# EAGLE schematic wordclock-r6-4x6 (EAGLE 5.11)
DIGIKEY: 300-8761-ND
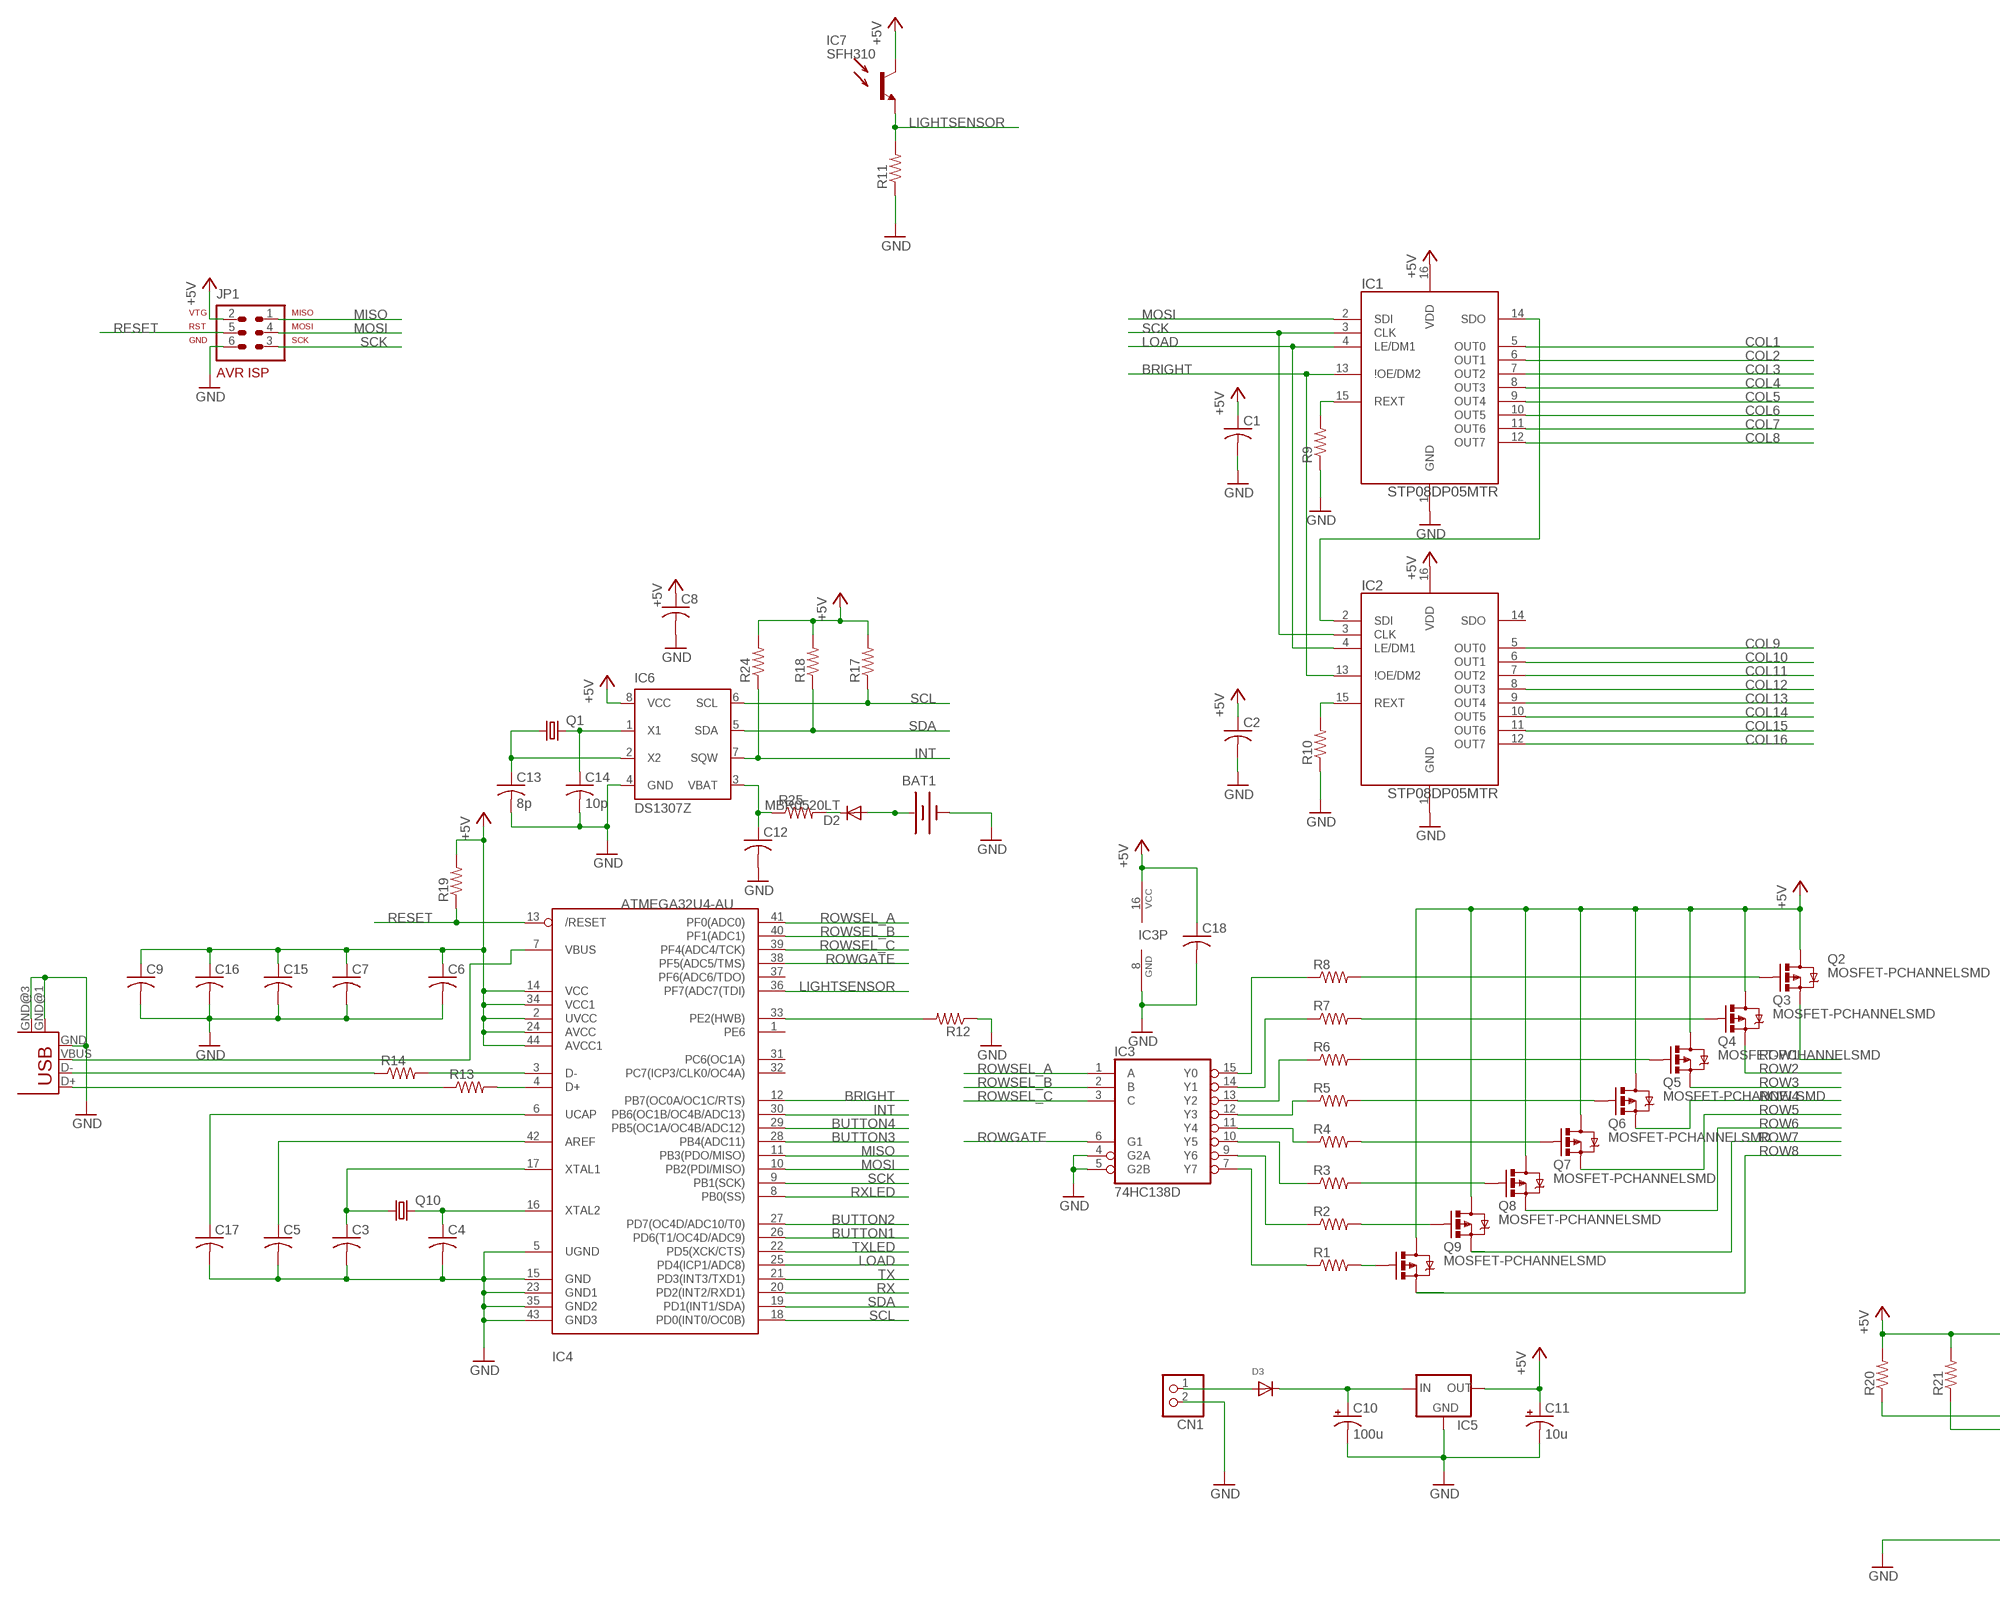
[diagram p0: schematic, sheet 1, part 1 of 2]
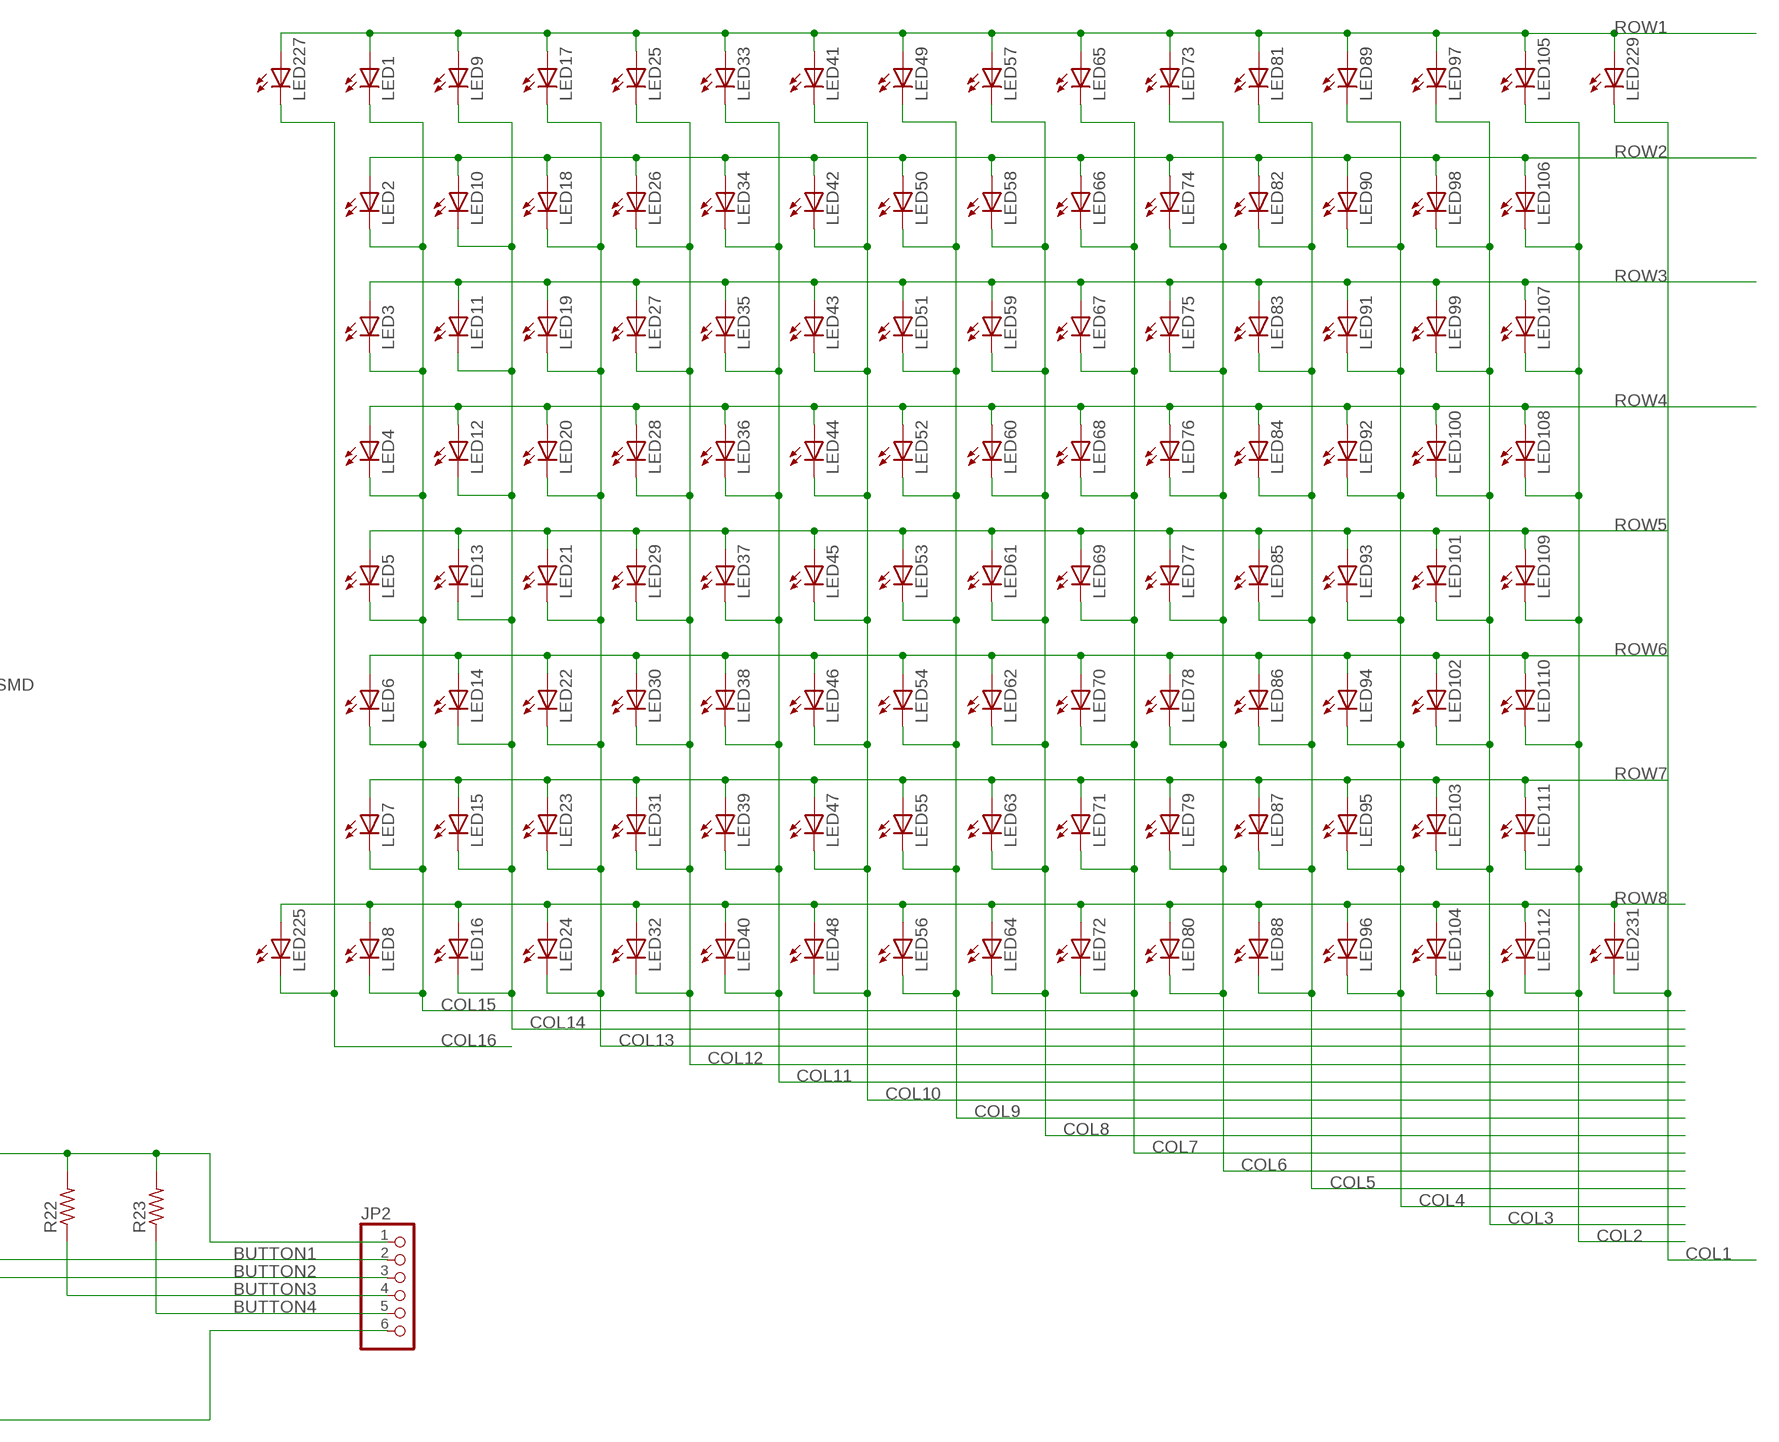
[diagram p1: schematic, sheet 1, part 2 of 2]

## Parts
BAT1  BATTERY12MM  [BATTCON_12MM]
C1  C-USC0603  [C0603]
C2  C-USC0603  [C0603]
C3  C-USC0603  [C0603]
C4  C-USC0603  [C0603]
C5  C-USC0603  [C0603]
C6  C-USC0603  [C0603]
C7  C-USC0603  [C0603]
C8  C-USC0603  [C0603]
C9  C-USC0603  [C0603]
C10  100u  CPOL-USD  [PANASONIC_D]
C11  10u  CPOL-USB  [PANASONIC_B]
C12  C-USC0603  [C0603]
C13  8p  C-USC0603  [C0603]
C14  10p  C-USC0603  [C0603]
C15  C-USC0603  [C0603]
C16  C-USC0603  [C0603]
C17  C-USC0603  [C0603]
C18  C-USC0603  [C0603]
CN1  JST_2PIN-SMT-RA  [JST-PH-2-SMT-RA]
D2  MBR0520LT  [SOD123]
D3  DIODESMA  [SMADIODE]
IC1  STP08DP05MTR  [SOIC-16]
IC2  STP08DP05MTR  [SOIC-16]
IC3  74HC138D  74LS138D  [SO16]
IC4  ATMEGA32U4-AU  [TQFP44]
IC5  LM1117  [SOT223]
IC6  DS1307Z  [SOIC8]
IC7  SFH310  [LED3MM]
JP1  AVR-ISP-6  [AVR-ISP-6]
JP2  PINHD-1X06_2.54-SMD-90°  [1X06SMD/90]
LED1  LEDKA-3528ASYC  [KA-3528ASYC]
LED2  LEDKA-3528ASYC  [KA-3528ASYC]
LED3  LEDKA-3528ASYC  [KA-3528ASYC]
LED4  LEDKA-3528ASYC  [KA-3528ASYC]
LED5  LEDKA-3528ASYC  [KA-3528ASYC]
LED6  LEDKA-3528ASYC  [KA-3528ASYC]
LED7  LEDKA-3528ASYC  [KA-3528ASYC]
LED8  LEDKA-3528ASYC  [KA-3528ASYC]
LED9  LEDKA-3528ASYC  [KA-3528ASYC]
LED10  LEDKA-3528ASYC  [KA-3528ASYC]
LED11  LEDKA-3528ASYC  [KA-3528ASYC]
LED12  LEDKA-3528ASYC  [KA-3528ASYC]
LED13  LEDKA-3528ASYC  [KA-3528ASYC]
LED14  LEDKA-3528ASYC  [KA-3528ASYC]
LED15  LEDKA-3528ASYC  [KA-3528ASYC]
LED16  LEDKA-3528ASYC  [KA-3528ASYC]
LED17  LEDKA-3528ASYC  [KA-3528ASYC]
LED18  LEDKA-3528ASYC  [KA-3528ASYC]
LED19  LEDKA-3528ASYC  [KA-3528ASYC]
LED20  LEDKA-3528ASYC  [KA-3528ASYC]
LED21  LEDKA-3528ASYC  [KA-3528ASYC]
LED22  LEDKA-3528ASYC  [KA-3528ASYC]
LED23  LEDKA-3528ASYC  [KA-3528ASYC]
LED24  LEDKA-3528ASYC  [KA-3528ASYC]
LED25  LEDKA-3528ASYC  [KA-3528ASYC]
LED26  LEDKA-3528ASYC  [KA-3528ASYC]
LED27  LEDKA-3528ASYC  [KA-3528ASYC]
LED28  LEDKA-3528ASYC  [KA-3528ASYC]
LED29  LEDKA-3528ASYC  [KA-3528ASYC]
LED30  LEDKA-3528ASYC  [KA-3528ASYC]
LED31  LEDKA-3528ASYC  [KA-3528ASYC]
LED32  LEDKA-3528ASYC  [KA-3528ASYC]
LED33  LEDKA-3528ASYC  [KA-3528ASYC]
LED34  LEDKA-3528ASYC  [KA-3528ASYC]
LED35  LEDKA-3528ASYC  [KA-3528ASYC]
LED36  LEDKA-3528ASYC  [KA-3528ASYC]
LED37  LEDKA-3528ASYC  [KA-3528ASYC]
LED38  LEDKA-3528ASYC  [KA-3528ASYC]
LED39  LEDKA-3528ASYC  [KA-3528ASYC]
LED40  LEDKA-3528ASYC  [KA-3528ASYC]
LED41  LEDKA-3528ASYC  [KA-3528ASYC]
LED42  LEDKA-3528ASYC  [KA-3528ASYC]
LED43  LEDKA-3528ASYC  [KA-3528ASYC]
LED44  LEDKA-3528ASYC  [KA-3528ASYC]
LED45  LEDKA-3528ASYC  [KA-3528ASYC]
LED46  LEDKA-3528ASYC  [KA-3528ASYC]
LED47  LEDKA-3528ASYC  [KA-3528ASYC]
LED48  LEDKA-3528ASYC  [KA-3528ASYC]
LED49  LEDKA-3528ASYC  [KA-3528ASYC]
LED50  LEDKA-3528ASYC  [KA-3528ASYC]
LED51  LEDKA-3528ASYC  [KA-3528ASYC]
LED52  LEDKA-3528ASYC  [KA-3528ASYC]
LED53  LEDKA-3528ASYC  [KA-3528ASYC]
LED54  LEDKA-3528ASYC  [KA-3528ASYC]
LED55  LEDKA-3528ASYC  [KA-3528ASYC]
LED56  LEDKA-3528ASYC  [KA-3528ASYC]
LED57  LEDKA-3528ASYC  [KA-3528ASYC]
LED58  LEDKA-3528ASYC  [KA-3528ASYC]
LED59  LEDKA-3528ASYC  [KA-3528ASYC]
LED60  LEDKA-3528ASYC  [KA-3528ASYC]
LED61  LEDKA-3528ASYC  [KA-3528ASYC]
LED62  LEDKA-3528ASYC  [KA-3528ASYC]
LED63  LEDKA-3528ASYC  [KA-3528ASYC]
LED64  LEDKA-3528ASYC  [KA-3528ASYC]
LED65  LEDKA-3528ASYC  [KA-3528ASYC]
LED66  LEDKA-3528ASYC  [KA-3528ASYC]
LED67  LEDKA-3528ASYC  [KA-3528ASYC]
LED68  LEDKA-3528ASYC  [KA-3528ASYC]
LED69  LEDKA-3528ASYC  [KA-3528ASYC]
LED70  LEDKA-3528ASYC  [KA-3528ASYC]
LED71  LEDKA-3528ASYC  [KA-3528ASYC]
LED72  LEDKA-3528ASYC  [KA-3528ASYC]
LED73  LEDKA-3528ASYC  [KA-3528ASYC]
LED74  LEDKA-3528ASYC  [KA-3528ASYC]
LED75  LEDKA-3528ASYC  [KA-3528ASYC]
LED76  LEDKA-3528ASYC  [KA-3528ASYC]
LED77  LEDKA-3528ASYC  [KA-3528ASYC]
LED78  LEDKA-3528ASYC  [KA-3528ASYC]
LED79  LEDKA-3528ASYC  [KA-3528ASYC]
LED80  LEDKA-3528ASYC  [KA-3528ASYC]
LED81  LEDKA-3528ASYC  [KA-3528ASYC]
LED82  LEDKA-3528ASYC  [KA-3528ASYC]
LED83  LEDKA-3528ASYC  [KA-3528ASYC]
LED84  LEDKA-3528ASYC  [KA-3528ASYC]
LED85  LEDKA-3528ASYC  [KA-3528ASYC]
LED86  LEDKA-3528ASYC  [KA-3528ASYC]
LED87  LEDKA-3528ASYC  [KA-3528ASYC]
LED88  LEDKA-3528ASYC  [KA-3528ASYC]
LED89  LEDKA-3528ASYC  [KA-3528ASYC]
LED90  LEDKA-3528ASYC  [KA-3528ASYC]
LED91  LEDKA-3528ASYC  [KA-3528ASYC]
LED92  LEDKA-3528ASYC  [KA-3528ASYC]
LED93  LEDKA-3528ASYC  [KA-3528ASYC]
LED94  LEDKA-3528ASYC  [KA-3528ASYC]
LED95  LEDKA-3528ASYC  [KA-3528ASYC]
LED96  LEDKA-3528ASYC  [KA-3528ASYC]
LED97  LEDKA-3528ASYC  [KA-3528ASYC]
LED98  LEDKA-3528ASYC  [KA-3528ASYC]
LED99  LEDKA-3528ASYC  [KA-3528ASYC]
LED100  LEDKA-3528ASYC  [KA-3528ASYC]
LED101  LEDKA-3528ASYC  [KA-3528ASYC]
LED102  LEDKA-3528ASYC  [KA-3528ASYC]
LED103  LEDKA-3528ASYC  [KA-3528ASYC]
LED104  LEDKA-3528ASYC  [KA-3528ASYC]
LED105  LEDKA-3528ASYC  [KA-3528ASYC]
LED106  LEDKA-3528ASYC  [KA-3528ASYC]
LED107  LEDKA-3528ASYC  [KA-3528ASYC]
LED108  LEDKA-3528ASYC  [KA-3528ASYC]
LED109  LEDKA-3528ASYC  [KA-3528ASYC]
LED110  LEDKA-3528ASYC  [KA-3528ASYC]
LED111  LEDKA-3528ASYC  [KA-3528ASYC]
LED112  LEDKA-3528ASYC  [KA-3528ASYC]
LED225  LEDKA-3528ASYC  [KA-3528ASYC]
LED227  LEDKA-3528ASYC  [KA-3528ASYC]
LED229  LEDKA-3528ASYC  [KA-3528ASYC]
LED231  LEDKA-3528ASYC  [KA-3528ASYC]
Q1  CRYSTALTC26H  [TC26H]
Q2  MOSFET-PCHANNELSMD  [SOT23-3]
Q3  MOSFET-PCHANNELSMD  [SOT23-3]
Q4  MOSFET-PCHANNELSMD  [SOT23-3]
Q5  MOSFET-PCHANNELSMD  [SOT23-3]
Q6  MOSFET-PCHANNELSMD  [SOT23-3]
Q7  MOSFET-PCHANNELSMD  [SOT23-3]
Q8  MOSFET-PCHANNELSMD  [SOT23-3]
Q9  MOSFET-PCHANNELSMD  [SOT23-3]
Q10  CRYSTALHC49UP  [HC49UP]
R1  R-US_R0603  [R0603]
R2  R-US_R0603  [R0603]
R3  R-US_R0603  [R0603]
R4  R-US_R0603  [R0603]
R5  R-US_R0603  [R0603]
R6  R-US_R0603  [R0603]
R7  R-US_R0603  [R0603]
R8  R-US_R0603  [R0603]
R9  R-US_R0603  [R0603]
R10  R-US_R0603  [R0603]
R11  R-US_R0603  [R0603]
R12  R-US_R0603  [R0603]
R13  R-US_R0603  [R0603]
R14  R-US_R0603  [R0603]
R17  R-US_R0603  [R0603]
R18  R-US_R0603  [R0603]
R19  R-US_R0603  [R0603]
R20  R-US_R0603  [R0603]
R21  R-US_R0603  [R0603]
R22  R-US_R0603  [R0603]
R23  R-US_R0603  [R0603]
R24  R-US_R0603  [R0603]
R25  R-US_R0603  [R0603]
USB1  USB-RAYMOND  [USB-MB-RAYMOND]

## Nets
+5V: C1.1 C2.1 C6.1 C7.1 C8.1 C9.1 C11.+ C15.1 C16.1 C18.1 IC1.16(VDD) IC2.16(VDD) IC3.16(VCC) IC4.2(UVCC) IC4.14(VCC) IC4.24(AVCC) IC4.34(VCC1) IC4.44(AVCC1) IC5.2(OUT) IC6.8(VCC) IC7.A(C) JP1.2 JP2.1 Q2.3(D) Q3.3(D) Q4.3(D) Q5.3(D) Q6.3(D) Q7.3(D) Q8.3(D) Q9.3(D) R17.2 R18.2 R19.2 R20.2 R21.2 R22.2 R23.2 R24.2
BRIGHT: IC1.13(\!OE/DM2) IC2.13(\!OE/DM2) IC4.12(PB7(OC0A/OC1C/RTS))
BUTTON1: IC4.26(PD6(T1/OC4D/ADC9)) JP2.2 R20.1
BUTTON2: IC4.27(PD7(OC4D/ADC10/T0)) JP2.3 R21.1
BUTTON3: IC4.28(PB4(ADC11)) JP2.4 R22.1
BUTTON4: IC4.29(PB5(OC1A/OC4B/ADC12)) JP2.5 R23.1
COL1: IC1.5(OUT0) LED229.C LED231.C
COL2: IC1.6(OUT1) LED105.C LED106.C LED107.C LED108.C LED109.C LED110.C LED111.C LED112.C
COL3: IC1.7(OUT2) LED97.C LED98.C LED99.C LED100.C LED101.C LED102.C LED103.C LED104.C
COL4: IC1.8(OUT3) LED89.C LED90.C LED91.C LED92.C LED93.C LED94.C LED95.C LED96.C
COL5: IC1.9(OUT4) LED81.C LED82.C LED83.C LED84.C LED85.C LED86.C LED87.C LED88.C
COL6: IC1.10(OUT5) LED73.C LED74.C LED75.C LED76.C LED77.C LED78.C LED79.C LED80.C
COL7: IC1.11(OUT6) LED65.C LED66.C LED67.C LED68.C LED69.C LED70.C LED71.C LED72.C
COL8: IC1.12(OUT7) LED57.C LED58.C LED59.C LED60.C LED61.C LED62.C LED63.C LED64.C
COL9: IC2.5(OUT0) LED49.C LED50.C LED51.C LED52.C LED53.C LED54.C LED55.C LED56.C
COL10: IC2.6(OUT1) LED41.C LED42.C LED43.C LED44.C LED45.C LED46.C LED47.C LED48.C
COL11: IC2.7(OUT2) LED33.C LED34.C LED35.C LED36.C LED37.C LED38.C LED39.C LED40.C
COL12: IC2.8(OUT3) LED25.C LED26.C LED27.C LED28.C LED29.C LED30.C LED31.C LED32.C
COL13: IC2.9(OUT4) LED17.C LED18.C LED19.C LED20.C LED21.C LED22.C LED23.C LED24.C
COL14: IC2.10(OUT5) LED9.C LED10.C LED11.C LED12.C LED13.C LED14.C LED15.C LED16.C
COL15: IC2.11(OUT6) LED1.C LED2.C LED3.C LED4.C LED5.C LED6.C LED7.C LED8.C
COL16: IC2.12(OUT7) LED225.C LED227.C
GND: BAT1.GND(-) C1.2 C2.2 C3.2 C4.2 C5.2 C6.2 C7.2 C8.2 C9.2 C10.- C11.- C12.2 C13.2 C14.2 C15.2 C16.2 C17.2 C18.2 CN1.2 IC1.1(GND) IC2.1(GND) IC3.4(G2A) IC3.5(G2B) IC3.8(GND) IC4.5(UGND) IC4.15(GND) IC4.23(GND1) IC4.35(GND2) IC4.43(GND3) IC5.1(GND) IC6.4(GND) JP1.6 JP2.6 R9.1 R10.1 R11.1 R12.1 USB1.GND USB1.GND@1(GND) USB1.GND@3(GND)
INT: IC4.30(PB6(OC1B/OC4B/ADC13)) IC6.7(SQW) R24.1
LIGHTSENSOR: IC4.36(PF7(ADC7(TDI)) IC7.K(E) R11.2
LOAD: IC1.4(LE/DM1) IC2.4(LE/DM1) IC4.25(PD4(ICP1/ADC8))
MISO: IC4.11(PB3(PDO/MISO)) JP1.1
MOSI: IC1.2(SDI) IC4.10(PB2(PDI/MISO)) JP1.4
N$1: C12.1 IC6.3(VBAT) R25.1
N$2: D2.C R25.2
N$3: C3.1 IC4.17(XTAL1) Q10.1
N$4: C4.1 IC4.16(XTAL2) Q10.2
N$5: IC1.14(SDO) IC2.2(SDI)
N$6: IC2.15(REXT) R10.2
N$7: IC1.15(REXT) R9.2
N$8: C17.1 IC4.6(UCAP)
N$9: IC4.33(PE2(HWB)) R12.2
N$10: Q2.1(G) R8.2
N$11: Q3.1(G) R7.2
N$12: Q4.1(G) R6.2
N$13: Q5.1(G) R5.2
N$14: Q6.1(G) R4.2
N$16: Q7.1(G) R3.2
N$17: Q8.1(G) R2.2
N$18: Q9.1(G) R1.2
N$19: IC3.7(Y7) R1.1
N$20: IC3.9(Y6) R2.1
N$21: IC3.10(Y5) R3.1
N$22: IC3.11(Y4) R4.1
N$23: IC3.12(Y3) R5.1
N$24: IC3.13(Y2) R6.1
N$25: IC3.14(Y1) R7.1
N$26: IC3.15(Y0) R8.1
N$27: R13.1 USB1.D+
N$28: IC4.4(D+) R13.2
N$29: IC4.3(D-) R14.2
N$30: R14.1 USB1.D-
N$31: IC4.7(VBUS) USB1.VBUS
N$37: C13.1 IC6.2(X2) Q1.1
N$54: C5.1 IC4.42(AREF)
N$55: C14.1 IC6.1(X1) Q1.2
N$56: CN1.1 D3.A
N$57: C10.+ D3.C IC5.3(IN)
N$58: BAT1.PWR@1(+) D2.A
RESET: IC4.13(/RESET) JP1.5 R19.1
ROW1: LED1.A LED9.A LED17.A LED25.A LED33.A LED41.A LED49.A LED57.A LED65.A LED73.A LED81.A LED89.A LED97.A LED105.A LED227.A LED229.A Q2.2(S)
ROW2: LED2.A LED10.A LED18.A LED26.A LED34.A LED42.A LED50.A LED58.A LED66.A LED74.A LED82.A LED90.A LED98.A LED106.A Q3.2(S)
ROW3: LED3.A LED11.A LED19.A LED27.A LED35.A LED43.A LED51.A LED59.A LED67.A LED75.A LED83.A LED91.A LED99.A LED107.A Q4.2(S)
ROW4: LED4.A LED12.A LED20.A LED28.A LED36.A LED44.A LED52.A LED60.A LED68.A LED76.A LED84.A LED92.A LED100.A LED108.A Q5.2(S)
ROW5: LED5.A LED13.A LED21.A LED29.A LED37.A LED45.A LED53.A LED61.A LED69.A LED77.A LED85.A LED93.A LED101.A LED109.A Q6.2(S)
ROW6: LED6.A LED14.A LED22.A LED30.A LED38.A LED46.A LED54.A LED62.A LED70.A LED78.A LED86.A LED94.A LED102.A LED110.A Q7.2(S)
ROW7: LED7.A LED15.A LED23.A LED31.A LED39.A LED47.A LED55.A LED63.A LED71.A LED79.A LED87.A LED95.A LED103.A LED111.A Q8.2(S)
ROW8: LED8.A LED16.A LED24.A LED32.A LED40.A LED48.A LED56.A LED64.A LED72.A LED80.A LED88.A LED96.A LED104.A LED112.A LED225.A LED231.A Q9.2(S)
ROWGATE: IC3.6(G1) IC4.38(PF5(ADC5/TMS))
ROWSEL_A: IC3.1(A) IC4.41(PF0(ADC0))
ROWSEL_B: IC3.2(B) IC4.40(PF1(ADC1))
ROWSEL_C: IC3.3(C) IC4.39(PF4(ADC4/TCK))
RX: IC4.20(PD2(INT2/RXD1))
RXLED: IC4.8(PB0(SS))
SCK: IC1.3(CLK) IC2.3(CLK) IC4.9(PB1(SCK)) JP1.3
SCL: IC4.18(PD0(INT0/OC0B)) IC6.6(SCL) R17.1
SDA: IC4.19(PD1(INT1/SDA)) IC6.5(SDA) R18.1
TX: IC4.21(PD3(INT3/TXD1))
TXLED: IC4.22(PD5(XCK/CTS))
Unconnected: IC2.14(SDO) IC4.1(PE6) IC4.31(PC6(OC1A)) IC4.32(PC7(ICP3/CLK0/OC4A)) IC4.37(PF6(ADC6/TDO))

## Library data of the parts
BAT1 = sfe-sparkfun:BATTERY: Battery Holders Various common sizes : AA, AAA, 20mm coin cell and 12mm coin cell.
C1-C9 C12-C18 = rcl:C-US: CAPACITOR, American symbol
C10 C11 = rcl:CPOL-US: POLARIZED CAPACITOR, American symbol
CN1 = adafruit:JST_2PIN: JST 2-Pin Connectors of various flavors SMT-RA (S2B-PH-SM4) 4UConnector #17311 SMT (B2B-PH-SM4) THM-RA (S2B-PH) THM (B2B-PH)
D2 = diode:MBR0520LT: SCHOTTKY BARRIER RECTIFIER Source: http://onsemi.com .. MBR0520LT1-D.pdf
D3 = adafruit:DIODE: Diode SMADIODE - SMA Surface Mount Package 20V 1A Schottky Diode Digikey: 641-1014-6-ND DO-1N4148 - Through Hole Small Current Diode SOD-123 20V 1 A (.5mV Vf) Schottky Diode - Digikey: MBRX120TPMSCT-ND SOD-323 10V 570mA (.38mV Vf, 3ns) Schottky Diode - Digikey: ZLLS410CT-ND SOD-523 30V 30mA Schottky Diode (RB751S-40TE61) - Digikey: RB751S-40TE61CT-ND SOT23-R/W - SOT23 Package (R = Solder Paste/Reflow Ovens, W = Hand-Soldering) BAT54Film 40V 300mA - Digikey: 497-7162-1-ND
IC1 IC2 = rbg-st-ledcontrol:STP08DP05
IC3 = 74xx-us:74*138: 3-line to 8-line DECODER/DEMULTIPLEXER
IC4 = adafruit:ATMEGA32U4: http://www.ladyada.net/library/eagle
IC5 = v-reg-3:LM1117
IC6 = ds1307_pcf8583:DS1307: I2C-Bus CLOCK/CALENDAR
IC7 = 0-svo:SFH310
JP1 = avr-5-4.16:AVR-ISP-6: AVR ISP-6 Serial Programming Header
JP2 = pinhead-2:PINHD-1X06: PIN HEADER
LED1-LED112 LED225 LED227 LED229 LED231 = led:LED: LED OSRAM: - CHIPLED LG R971, LG N971, LY N971, LG Q971, LY Q971, LO R971, LY R971 LH N974, LH R974 LS Q976, LO Q976, LY Q976 LO Q996 - Hyper CHIPLED LW Q18S LB Q993, LB Q99A, LB R99A - SideLED LS A670, LO A670, LY A670, LG A670, LP A670 LB A673, LV A673, LT A673, LW A673 LH A674 LY A675 LS A676, LA A676, LO A676, LY A676, LW A676 LS A679, LY A679, LG A679 - Hyper Micro SIDELED® LS Y876, LA Y876, LO Y876, LY Y876 LT Y87S - SmartLED LW L88C, LW L88S LB L89C, LB L89S, LG L890 LS L89K, LO L89K, LY L89K LS L896, LA L896, LO L896, LY L896 - TOPLED LS T670, LO T670, LY T670, LG T670, LP T670 LSG T670, LSP T670, LSY T670, LOP T670, LYG T670 LG T671, LOG T671, LSG T671 LB T673, LV T673, LT T673, LW T673 LH T674 LS T676, LA T676, LO T676, LY T676, LB T676, LH T676, LSB T676, LW T676 LB T67C, LV T67C, LT T67C, LS T67K, LO T67K, LY T67K, LW E67C LS E67B, LA E67B, LO E67B, LY E67B, LB E67C, LV E67C, LT E67C LW T67C LS T679, LY T679, LG T679 LS T770, LO T770, LY T770, LG T770, LP T770 LB T773, LV T773, LT T773, LW T773 LH T774 LS E675, LA E675, LY E675, LS T675 LS T776, LA T776, LO T776, LY T776, LB T776 LHGB T686 LT T68C, LB T68C - Hyper Mini TOPLED® LB M676 - Mini TOPLED Santana® LG M470 LS M47K, LO M47K, LY M47K Source: http://www.osram.convergy.de LUXEON: - LUMILED® LXK2-PW12-R00, LXK2-PW12-S00, LXK2-PW14-U00, LXK2-PW14-V00 LXK2-PM12-R00, LXK2-PM12-S00, LXK2-PM14-U00 LXK2-PE12-Q00, LXK2-PE12-R00, LXK2-PE12-S00, LXK2-PE14-T00, LXK2-PE14-U00 LXK2-PB12-K00, LXK2-PB12-L00, LXK2-PB12-M00, LXK2-PB14-N00, LXK2-PB14-P00, LXK2-PB14-Q00 LXK2-PR12-L00, LXK2-PR12-M00, LXK2-PR14-Q00, LXK2-PR14-R00 LXK2-PD12-Q00, LXK2-PD12-R00, LXK2-PD12-S00 LXK2-PH12-R00, LXK2-PH12-S00 LXK2-PL12-P00, LXK2-PL12-Q00, LXK2-PL12-R00 Source: www.luxeon.com KINGBRIGHT: KA-3528ASYC Source: www.kingbright.com
Q1 Q10 = crystal:CRYSTAL: CRYSTAL; OC_FARNELL: unknown; OC_NEWARK: unknown
Q2-Q9 = SparkFun:MOSFET-PCHANNEL
R1-R14 R17-R25 = rcl:R-US_: RESISTOR, American symbol
USB1 = con-usb-2:USB: USB Connectors